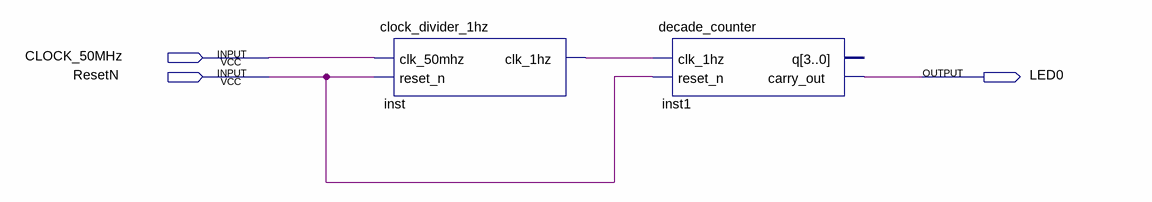
[diagram p0: schematic sheet]
// Quartus schematic DigitalClock.bdf as structural Verilog: 2 symbols, 3 pins
module DigitalClock (
  input  CLOCK_50MHz,
  input  ResetN,
  output LED0
);

  wire inst_clk_1hz;

  clock_divider_1hz inst (.clk_50mhz(CLOCK_50MHz), .reset_n(ResetN), .clk_1hz(inst_clk_1hz));
  decade_counter inst1 (.clk_1hz(inst_clk_1hz), .reset_n(ResetN), .carry_out(LED0));  // open: q
endmodule
